# EAGLE design openHCOP-micro (EAGLE 9.3.1)
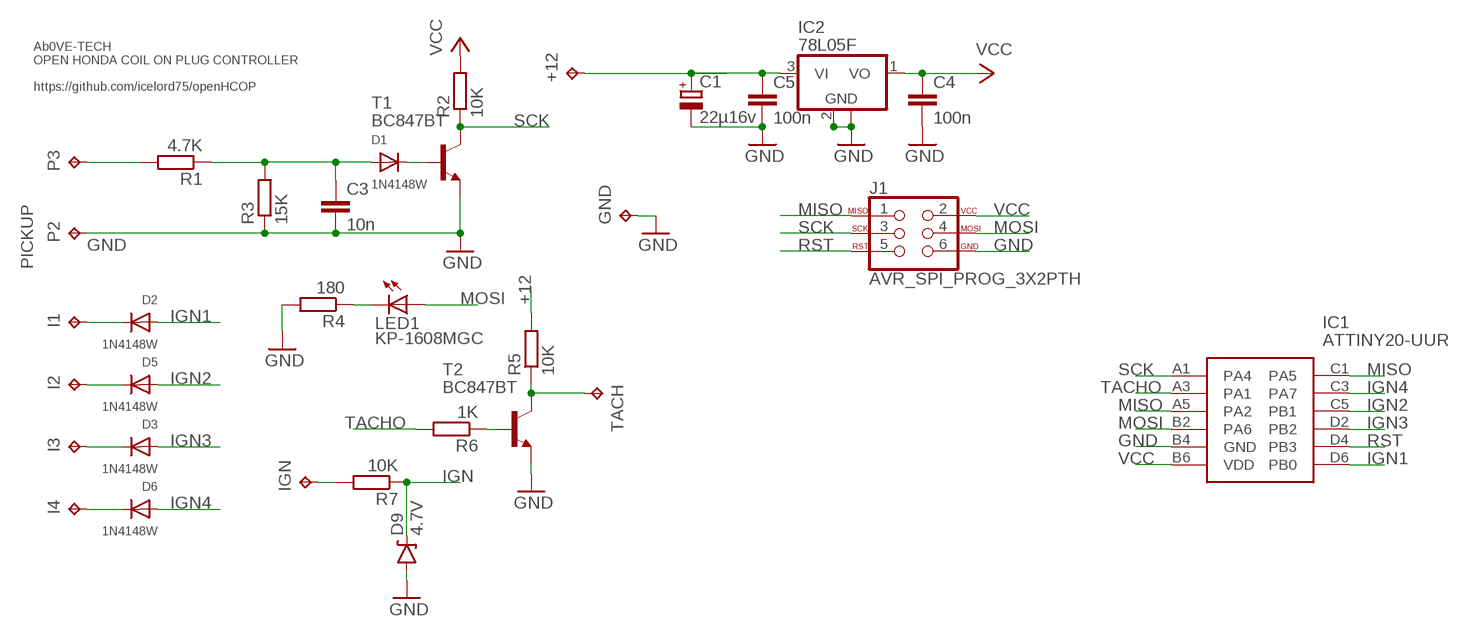
[diagram p0: schematic, sheet 1]

## Parts
+12  TPPAD1-13Y  [P1-13Y]
C1  22µ16v  CPOL-EUSMCB  [SMC_B]
C3  10n  C-EUC0402  [C0402]
C4  100n  C-EUC0402  [C0402]
C5  100n  C-EUC0402  [C0402]
D1  1N4148W  BAS16L  [SOD882(T)]
D2  1N4148W  BAS16L  [SOD882(T)]
D3  1N4148W  BAS16L  [SOD882(T)]
D5  1N4148W  BAS16L  [SOD882(T)]
D6  1N4148W  BAS16L  [SOD882(T)]
D9  4.7V  DIODE-ZENER16V  [SOD-123]
GND  TPPAD1-13Y  [P1-13Y]
I1  TPPAD1-13Y  [P1-13Y]
I2  TPPAD1-13Y  [P1-13Y]
I3  TPPAD1-13Y  [P1-13Y]
I4  TPPAD1-13Y  [P1-13Y]
IC1  ATTINY20-UUR  [BGA12C40P6X4_156X140X54]
IC2  78L05F  [SOT89]
IGN  TPPAD1-13Y  [P1-13Y]
J1  AVR_SPI_PROG_3X2PTH  [2X3]
LED1  KP-1608MGC  LEDCHIPLED_0603  [CHIPLED_0603]
P2  TPPAD1-13Y  [P1-13Y]
P3  TPPAD1-13Y  [P1-13Y]
R1  4.7K  R-EU_R0402  [R0402]
R2  10K  R-EU_R0402  [R0402]
R3  15K  R-EU_R0402  [R0402]
R4  180  R-EU_R0402  [R0402]
R5  10K  R-EU_R0402  [R0402]
R6  1K  R-EU_R0402  [R0402]
R7  10K  R-EU_R0402  [R0402]
T1  BC847BT  [SOT416]
T2  BC847BT  [SOT416]
TACH  TPPAD1-13Y  [P1-13Y]

## Nets
+12: +12.TP C1.+ C5.1 IC2.3(VI) R5.2
GND: C1.- C3.2 C4.2 C5.2 D9.A GND.TP IC1.B4(GND) IC2.2(GND) IC2.2@1(GND) J1.6 P2.TP R3.1 R4.2 T1.2(E) T2.2(E)
IGN: D9.C R7.1
IGN1: D2.2(A) IC1.D6(PB0)
IGN2: D5.2(A) IC1.C5(PB1)
IGN3: D3.2(A) IC1.D2(PB2)
IGN4: D6.2(A) IC1.C3(PA7)
MISO: IC1.A5(PA2) IC1.C1(PA5) J1.1
MOSI: IC1.B2(PA6) J1.4 LED1.A
N$1: R6.1 T2.1(B)
N$3: IGN.TP R7.2
N$4: D1.1(K) T1.1(B)
N$5: LED1.C R4.1
N$6: R5.1 T2.3(C) TACH.TP
N$8: D2.1(K) I1.TP
N$10: D5.1(K) I2.TP
N$12: D6.1(K) I4.TP
N$13: D3.1(K) I3.TP
N$14: C3.1 D1.2(A) R1.1 R3.2
PICKUP: P3.TP R1.2
RST: IC1.D4(PB3) J1.5
SCK: IC1.A1(PA4) J1.3 R2.1 T1.3(C)
TACHO: IC1.A3(PA1) R6.2
VCC: C4.1 IC1.B6(VDD) IC2.1(VO) J1.2 R2.2

## Notes on the sheet
- Ab0VE-TECH
  OPEN HONDA COIL ON PLUG CONTROLLER
  
  https://github.com/icelord75/openHCOP

## Library data of the parts
+12 GND I1-I4 IGN P2 P3 TACH = testpad:TP: Test pad
C1 = rcl:CPOL-EU: POLARIZED CAPACITOR, European symbol
C3-C5 = rcl:C-EU: CAPACITOR, European symbol
D1-D3 D5 D6 = nxp_60:BAS16: High-speed switching diode High-speed switching diode, encapsulated in small Surface-Mounted Device (SMD) plastic packages. AAL Eindhoven MK
D9 = SparkFun-DiscreteSemi:DIODE-ZENER: Zener Diode Production Part - 8199 3.4V Zener Voltage; PROD_ID: DIO-12440; VALUE: 16V
IC1 = ATTINY20-UUR:ATTINY20-UUR: 8-bit Microcontrollers - MCU 12MHz, 12 ball WLCSP Ind.Grade, T&R Source: Datasheet <http://ww1.microchip.com/downloads/en/DeviceDoc/Atmel-8235-8-bit-AVR-Microcontroller-ATtiny20_Datasheet.pdf>; DESCRIPTION: 8-bit Microcontrollers - MCU 12MHz, 12 ball WLCSP Ind.Grade, T&R; HEIGHT: 0.538mm; MANUFACTURER_NAME: Microchip; MANUFACTURER_PART_NUMBER: ATTINY20-UUR; MOUSER_PART_NUMBER: 556-ATTINY20-UUR; MOUSER_PRICE-STOCK: https://www.mouser.com/Search/Refine.aspx?Keyword=556-ATTINY20-UUR; RS_PART_NUMBER: 556-ATTINY20-UUR; RS_PRICE-STOCK: https://www.mouser.com/Search/Refine.aspx?Keyword=556-ATTINY20-UUR
IC2 = linear:78L*: POSITOIV-VOLTAGE REGULATORS Output up to 100 mA Source: Datasheet <http://focus.ti.com/lit/ds/symlink/ua78l05.pdf>
J1 = SparkFun-Connectors:AVR_SPI_PROG_3X2: AVR ISP 6 Pin This is the reduced ISP connector for AVR programming. Common on Arduino. This footprint will take up less PCB space and can be used with a 10-pin to 6-pin adapter such as SKU: BOB-08508 **Special note about "TEST_POINT" package. The stop mask is on the top side, so if you want your programming test points to be on the bottom of your board, make sure to place this package on the bottom side of the board. This also ensure that the orientation to program from the bottom side will be correct. SparkFun Products: SparkFun ISP Pogo Adapter <https://www.sparkfun.com/products/11591> - NS Tiny AVR Programmer <https://www.sparkfun.com/products/11801> -PTH
LED1 = led:LED: LED OSRAM: - CHIPLED LG R971, LG N971, LY N971, LG Q971, LY Q971, LO R971, LY R971 LH N974, LH R974 LS Q976, LO Q976, LY Q976 LO Q996 - Hyper CHIPLED LW Q18S LB Q993, LB Q99A, LB R99A - SideLED LS A670, LO A670, LY A670, LG A670, LP A670 LB A673, LV A673, LT A673, LW A673 LH A674 LY A675 LS A676, LA A676, LO A676, LY A676, LW A676 LS A679, LY A679, LG A679 - Hyper Micro SIDELED® LS Y876, LA Y876, LO Y876, LY Y876 LT Y87S - SmartLED LW L88C, LW L88S LB L89C, LB L89S, LG L890 LS L89K, LO L89K, LY L89K LS L896, LA L896, LO L896, LY L896 - TOPLED LS T670, LO T670, LY T670, LG T670, LP T670 LSG T670, LSP T670, LSY T670, LOP T670, LYG T670 LG T671, LOG T671, LSG T671 LB T673, LV T673, LT T673, LW T673 LH T674 LS T676, LA T676, LO T676, LY T676, LB T676, LH T676, LSB T676, LW T676 LB T67C, LV T67C, LT T67C, LS T67K, LO T67K, LY T67K, LW E67C LS E67B, LA E67B, LO E67B, LY E67B, LB E67C, LV E67C, LT E67C LW T67C LS T679, LY T679, LG T679 LS T770, LO T770, LY T770, LG T770, LP T770 LB T773, LV T773, LT T773, LW T773 LH T774 LS E675, LA E675, LY E675, LS T675 LS T776, LA T776, LO T776, LY T776, LB T776 LHGB T686 LT T68C, LB T68C - Hyper Mini TOPLED® LB M676 - Mini TOPLED Santana® LG M470 LS M47K, LO M47K, LY M47K Source: http://www.osram.convergy.de LUXEON: - LUMILED® LXK2-PW12-R00, LXK2-PW12-S00, LXK2-PW14-U00, LXK2-PW14-V00 LXK2-PM12-R00, LXK2-PM12-S00, LXK2-PM14-U00 LXK2-PE12-Q00, LXK2-PE12-R00, LXK2-PE12-S00, LXK2-PE14-T00, LXK2-PE14-U00 LXK2-PB12-K00, LXK2-PB12-L00, LXK2-PB12-M00, LXK2-PB14-N00, LXK2-PB14-P00, LXK2-PB14-Q00 LXK2-PR12-L00, LXK2-PR12-M00, LXK2-PR14-Q00, LXK2-PR14-R00 LXK2-PD12-Q00, LXK2-PD12-R00, LXK2-PD12-S00 LXK2-PH12-R00, LXK2-PH12-S00 LXK2-PL12-P00, LXK2-PL12-Q00, LXK2-PL12-R00 Source: www.luxeon.com KINGBRIGHT: KA-3528ASYC Source: www.kingbright.com
R1-R7 = rcl:R-EU_: RESISTOR, European symbol
T1 T2 = NXP_60_26022015:BC847: 45 V, 100 mA NPN general-purpose transistors NPN general-purpose transistor AAL Eindhoven MK

## Board
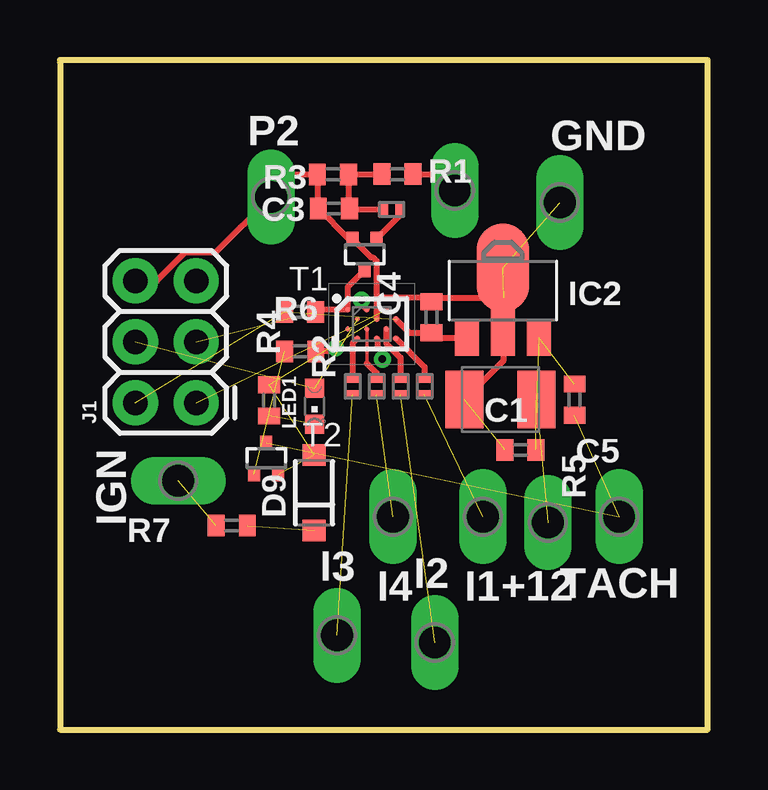
[diagram p1: board, top side]
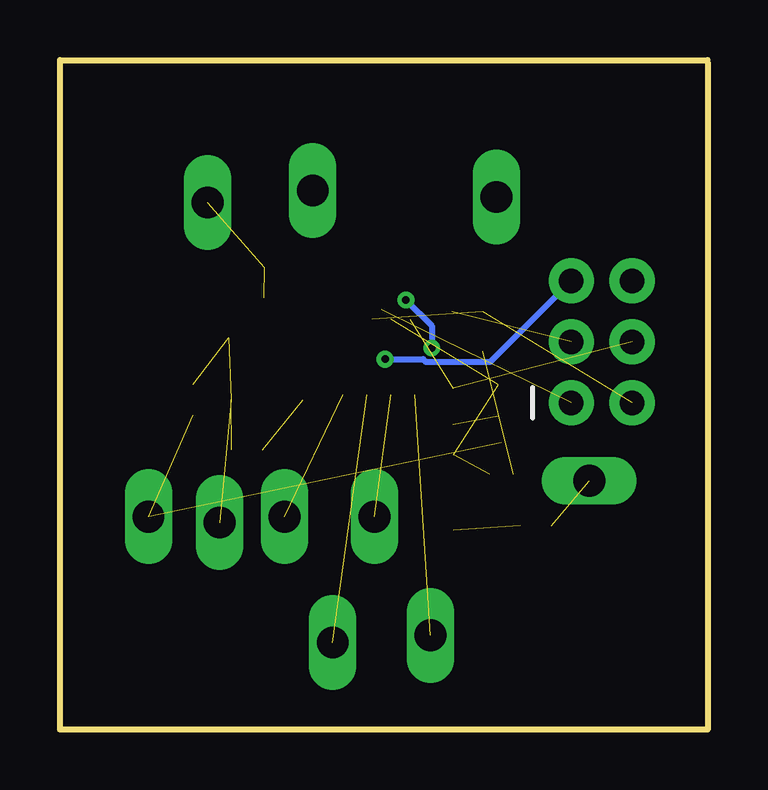
[diagram p2: board, bottom side, seen from below]

Size 27 x 27.9 mm. Coordinates in mm from the lower left corner, seen from the top.
Outline: 0,27.8 0,0 27,0 27,27.9 0,27.9
Copper layers (1*16): Top 0.035mm / dielectric 1.5mm / Bottom 0.035mm
Design rules "default *": minimum track width 10mil, minimum drill 0.3mm, track to track 0.1mm, track to pad 0.1mm, pad to pad 8mil, via to via 8mil, smd to smd 0.1mm, copper to edge 40mil, drill to drill 8mil, minimum pad ring 10mil, minimum via ring 8mil, stop-mask expansion 4mil, vias tented up to drill 0mil, thermal gap 10mil

### Footprints (pad centres in the part's own frame; a part is rotated, then mirrored left to right if it is on the bottom)
P1-13Y = drill 1.321 pad 1.905 long: TP 0,0
SMC_B = smd 1.6 x 2.4: + -1.5,0; - 1.5,0
C0402 = smd 0.7 x 0.9: 1 -0.65,0; 2 0.65,0
SOD882(T) = smd 0.4 x 0.7: 1 -0.35,0; 2 0.35,0
SOD-123 = smd 0.9 x 0.95: A 1.575,0; C -1.575,0
BGA12C40P6X4_156X140X54 = smd 0.215 x 0.215: A1 -1,0.6; A3 -0.2,0.6; A5 0.6,0.6; B2 -0.6,0.2; B4 0.2,0.2; B6 1,0.2; C1 -1,-0.2; C3 -0.2,-0.2; C5 0.6,-0.2; D2 -0.6,-0.6; D4 0.2,-0.6; D6 1,-0.6
SOT89 = smd 1 x 1.5: 1 -1.499,-1.981; 3 1.499,-1.981 | smd 1 x 2: 2 0,-1.727 | smd 2.2 x 3.7: 2@1 0,0.94
2X3 = drill 1.016 pad 1.88: 1 0,0; 2 0,2.54; 3 2.54,0; 4 2.54,2.54; 5 5.08,0; 6 5.08,2.54
CHIPLED_0603 = smd 0.8 x 0.8: A 0,-0.75; C 0,0.75
R0402 = smd 0.7 x 0.9: 1 -0.65,0; 2 0.65,0
SOT416 = smd 0.5 x 0.6: 1 -0.5,-0.65; 2 0.5,-0.65; 3 0,0.65

### Placement (x,y rotation side)
+12  20.35,8.63 180 top
C1  18.36,13.75 180 top
C3  11.42,21.71 180 top
C4  15.49,17.18 90 top
C5  19.2,11.65 180 top
D1  13.83,21.68 180 top
D2  15.2,14.3 90 top
D3  12.2,14.3 90 top
D5  14.2,14.3 90 top
D6  13.2,14.3 90 top
D9  10.6,9.87 90 top
GND  20.85,21.96 0 top
I1  17.63,8.87 0 top
I2  15.63,3.63 180 top
I3  11.56,3.93 180 top
I4  13.88,8.87 0 top
IC1  13,16.9 0 top
IC2  18.47,18.3 0 top
IGN  4.93,10.37 270 top
J1  5.69,13.61 90 top
LED1  10.62,13.48 180 top
P2  8.8,22.19 180 top
P3  16.46,22.46 0 top
R1  14.07,23.14 0 top
R2  10.01,17.41 180 top
R3  11.38,23.14 0 top
R4  8.72,13.72 90 top
R5  21.45,13.75 90 top
R6  10.01,15.76 0 top
R7  7.16,8.5 180 top
T1  12.7,19.8 180 top
T2  8.6,11.3 0 top
TACH  23.31,8.87 0 top

### Tracks (layer width: path | path; a pad name or v marks a point on that pad's centre or on a via)
+12  (4 unrouted)
GND  (6 unrouted)
  Top 0.254: 13.2,18 13.2,19.52 13.04,19.68 12.97,19.68 T1.2 12.04,20.45 C3.2 10.73,21.76 R3.1 9.75,23.14 P2.TP 6.48,19.86 5.2,19.86 4.04,18.7 J1.6 | 13.2,18 IC1.B4 | 13.2,18 15.32,18 C4.2 15.66,18 18.5,18 18.5,16.61 | 18.5,16.61 IC2.2 | C1.- 18.5,15.39 18.5,16.61
IGN  (1 unrouted)
IGN1
  Top 0.254: IC1.D6 15.2,15.1 D2.2
IGN2
  Top 0.254: IC1.C5 13.6,16.1 14.2,15.5 D5.2
IGN3
  Top 0.254: IC1.D2 12.2,16.1 D3.2
IGN4
  Top 0.152: IC1.C3 12.8,15.25
  Top 0.254: D6.2 13.2,14.85 12.8,15.25
MISO  (2 unrouted)
MOSI  (2 unrouted)
N$1  (1 unrouted)
N$3  (1 unrouted)
N$4
  Top 0.254: T1.1 14.18,21.43 D1.1
N$5  (1 unrouted)
N$6  (2 unrouted)
N$8  (1 unrouted)
N$10  (1 unrouted)
N$12  (1 unrouted)
N$13  (1 unrouted)
N$14
  Top 0.254: R1.1 R3.2 12.03,21.76 C3.1 12.11,21.68 D1.2
PICKUP
  Top 0.254: R1.2 15.78,23.14 P3.TP
RST  (via drill 0.3)
  Top 0.254: IC1.D4 13.25,16.25 13.25,15.95 13.44,15.76 v13.44,15.44
  Bottom 0.254: v13.44,15.44 11.86,15.44 11.74,15.32 9.06,15.32 J1.5
SCK  (1 unrouted)
  Top 0.254: T1.3 12,18.45 IC1.A1 10.75,17.5 R2.1
TACHO  (via drill 0.3)
  Top 0.254: IC1.A3 12.58,17.72 v12.58,17.9 | v11.5,15.9 11.36,15.76 R6.2
  Bottom 0.254: v12.58,17.9 11.5,16.82 v11.5,15.9
VCC  (2 unrouted)
  Top 0.254: IC1.B6 14.57,16.53 C4.1 15.7,16.32 IC2.1